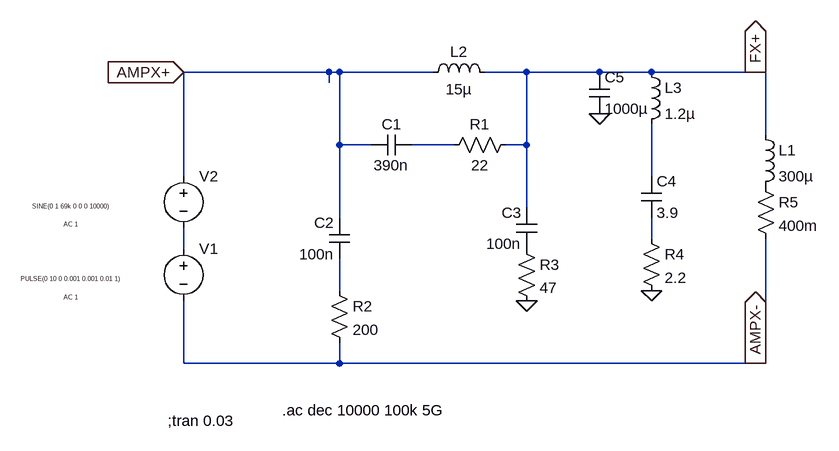
[diagram p0: schematic Draft1.asc]
Draft1.asc, the LTspice schematic file:
Version 4
SHEET 1 880 680
WIRE 16 -208 -208 -208
WIRE 32 -208 16 -208
WIRE 176 -208 32 -208
WIRE 320 -208 256 -208
WIRE 432 -208 320 -208
WIRE 512 -208 432 -208
WIRE 672 -208 512 -208
WIRE 688 -208 672 -208
WIRE 16 -192 16 -208
WIRE 688 -112 688 -208
WIRE 32 -96 32 -208
WIRE 80 -96 32 -96
WIRE 208 -96 144 -96
WIRE 320 -96 320 -208
WIRE 320 -96 288 -96
WIRE -208 -48 -208 -208
WIRE 512 -48 512 -128
WIRE 320 0 320 -96
WIRE 32 16 32 -96
WIRE 512 48 512 16
WIRE -208 64 -208 32
WIRE 32 128 32 80
WIRE -208 240 -208 144
WIRE 32 240 32 208
WIRE 32 240 -208 240
WIRE 672 240 32 240
WIRE 688 240 688 48
WIRE 688 240 672 240
FLAG -208 -208 AMPX+
IOPIN -208 -208 In
FLAG 672 -208 FX+
IOPIN 672 -208 Out
FLAG 672 240 AMPX-
IOPIN 672 240 Out
FLAG 320 144 0
FLAG 512 128 0
FLAG 432 -144 0
SYMBOL voltage -208 48 R0
WINDOW 3 -173 62 Center 0
WINDOW 123 -173 90 Center 0
WINDOW 39 0 0 Left 0
SYMATTR Value PULSE(0 10 0 0.001 0.001 0.01 1)
SYMATTR Value2 AC 1
SYMATTR InstName V1
SYMBOL res 672 -48 R0
SYMATTR InstName R5
SYMATTR Value 400m
SYMBOL ind 160 -192 R270
WINDOW 0 32 56 VTop 2
WINDOW 3 5 56 VBottom 2
SYMATTR InstName L2
SYMATTR Value 15µ
SYMBOL voltage -208 -64 R0
WINDOW 3 -173 62 Center 0
WINDOW 123 -173 90 Center 0
WINDOW 39 0 0 Left 0
SYMATTR Value SINE(0 1 69k 0 0 0 10000)
SYMATTR Value2 AC 1
SYMATTR InstName V2
SYMBOL cap 144 -112 R90
WINDOW 0 0 32 VBottom 2
WINDOW 3 32 32 VTop 2
SYMATTR InstName C1
SYMATTR Value 390n
SYMBOL res 304 -112 R90
WINDOW 0 0 56 VBottom 2
WINDOW 3 32 56 VTop 2
SYMATTR InstName R1
SYMATTR Value 22
SYMBOL cap 48 80 R180
WINDOW 0 24 56 Left 2
WINDOW 3 24 8 Left 2
SYMATTR InstName C2
SYMATTR Value 100n
SYMBOL res 16 112 R0
SYMATTR InstName R2
SYMATTR Value 200
SYMBOL cap 336 64 R180
WINDOW 0 24 56 Left 2
WINDOW 3 24 8 Left 2
SYMATTR InstName C3
SYMATTR Value 100n
SYMBOL res 304 48 R0
SYMATTR InstName R3
SYMATTR Value 47
SYMBOL ind 496 -224 R0
SYMATTR InstName L3
SYMATTR Value 1.2µ
SYMBOL cap 496 -48 R0
SYMATTR InstName C4
SYMATTR Value 3.9
SYMBOL res 496 32 R0
SYMATTR InstName R4
SYMATTR Value 2.2
SYMBOL ind 672 -128 R0
SYMATTR InstName L1
SYMATTR Value 300µ
SYMBOL cap 416 -208 R0
SYMATTR InstName C5
SYMATTR Value 1000µ
TEXT -232 328 Left 2 !;tran 0.03
TEXT -56 312 Left 2 !.ac dec 10000 100k 5G

The netlist it stands for:
* Draft1.asc
V1 N004 AMPX- PULSE(0 10 0 0.001 0.001 0.01 1) AC 1
R5 P001 AMPX- 400m
L2 AMPX+ FX+ 15µ
V2 AMPX+ N004 SINE(0 1 69k 0 0 0 10000) AC 1
C1 N001 AMPX+ 390n
R1 FX+ N001 22
C2 N005 AMPX+ 100n
R2 N005 AMPX- 200
C3 P002 FX+ 100n
R3 P002 0 47
L3 FX+ N002 1.2µ
C4 N002 N003 3.9
R4 N003 0 2.2
L1 FX+ P001 300µ
C5 FX+ 0 1000µ
;tran 0.03
.ac dec 10000 100k 5G
.backanno
.end